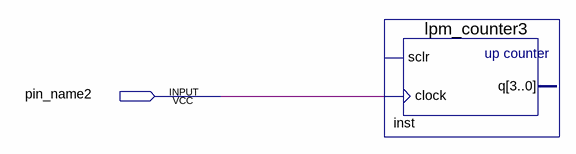
[diagram p0: schematic sheet]
// Quartus schematic counter.bdf as structural Verilog: 1 symbols, 1 pins
module counter (
  input  pin_name2
);

  lpm_counter3 inst (.clock(pin_name2));  // open: sclr, q
endmodule
